# EAGLE design CajitaAbierta_v06_robotique (EAGLE 9.6.2)
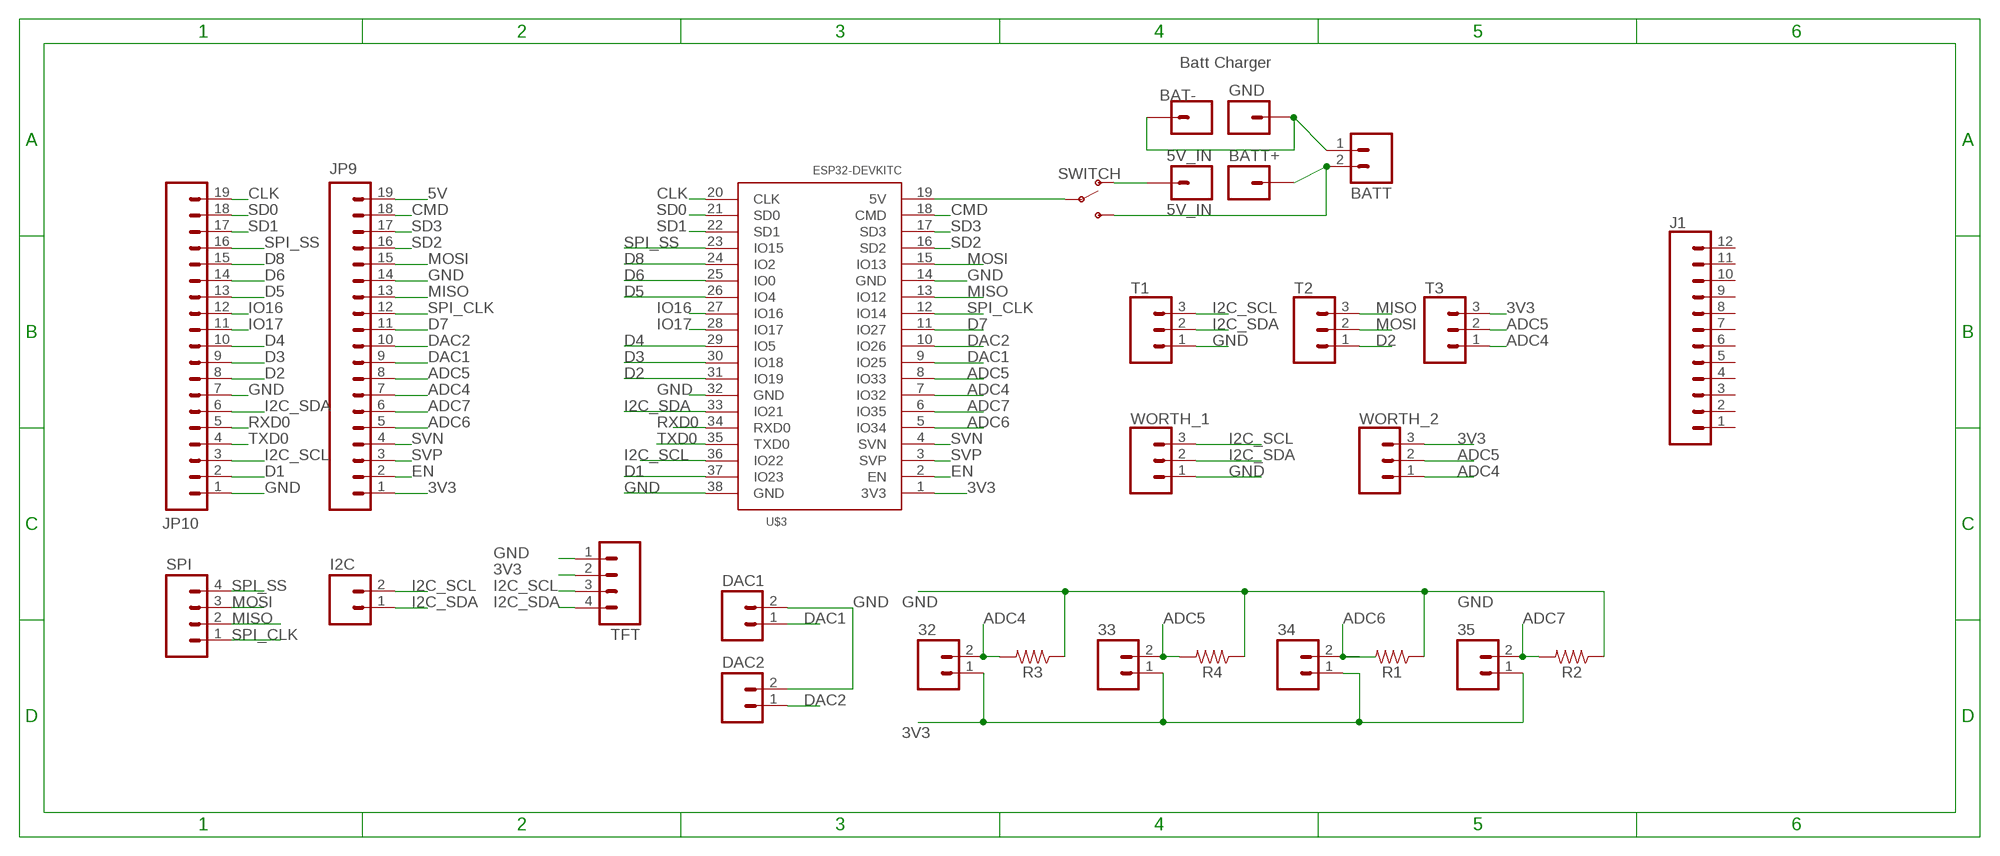
[diagram p0: schematic, sheet 1]

## Parts
5V_IN  5V_IN  M01PTH  [1X01]
32  M02PTH  [1X02]
33  M02PTH  [1X02]
34  M02PTH  [1X02]
35  M02PTH  [1X02]
BAT-  M01PTH  [1X01]
BATT  M02LOCK_LONGPADS  [1X02_LOCK_LONGPADS]
BATT+  M01PTH  [1X01]
DAC1  M02PTH  [1X02]
DAC2  M02PTH  [1X02]
GND  Batt Charger  M01PTH  [1X01]
I2C  M02PTH  [1X02]
J1  CONN_12NO_SILK  [1X12_NO_SILK]
JP9  M191X19  [1X19]
JP10  M191X19  [1X19]
R1  RESISTOR1206  [1206]
R2  RESISTOR1206  [1206]
R3  RESISTOR1206  [1206]
R4  RESISTOR1206  [1206]
SPI  M04PTH  [1X04]
SWITCH  SWITCH-SPDT-SMD-RIGHT-ANGLE  [SWITCH_SPST_SMD_A]
T1  CONN_03SCREW-NS  [SCREWTERMINAL-3.5MM-3-NS]
T2  CONN_03SCREW-NS  [SCREWTERMINAL-3.5MM-3-NS]
T3  CONN_03SCREW-NS  [SCREWTERMINAL-3.5MM-3-NS]
TFT  M04PTH  [1X04]
U$3  ESP32DEVKITC  [ESP32-DEVKITC]
WORTH_1  CONN_03-SCREW-5MM  [SCREWTERMINAL-5MM-3]
WORTH_2  CONN_03-SCREW-5MM  [SCREWTERMINAL-5MM-3]

## Nets
3V3: 32.1 33.1 34.1 35.1 JP9.1 T3.3 TFT.2 U$3.1(3V3) WORTH_2.3
5V: JP9.19 SWITCH.2(P) U$3.19(5V)
5V_IN: 5V_IN.1 SWITCH.1(O)
ADC4: 32.2 JP9.7 R3.2 T3.1 U$3.7(IO32) WORTH_2.1
ADC5: 33.2 JP9.8 R4.2 T3.2 U$3.8(IO33) WORTH_2.2
ADC6: 34.2 JP9.5 R1.2 U$3.5(IO34)
ADC7: 35.2 JP9.6 R2.2 U$3.6(IO35)
BATT+: BATT+.1 BATT.2 SWITCH.3(S)
CLK: JP10.19 U$3.20(CLK)
CMD: JP9.18 U$3.18(CMD)
D1: JP10.2 U$3.37(IO23)
D2: JP10.8 T2.1 U$3.31(IO19)
D3: JP10.9 U$3.30(IO18)
D4: JP10.10 U$3.29(IO5)
D5: JP10.13 U$3.26(IO4)
D6: JP10.14 U$3.25(IO0)
D7: JP9.11 U$3.11(IO27)
D8: JP10.15 U$3.24(IO2)
DAC1: DAC1.1 JP9.9 U$3.9(IO25)
DAC2: DAC2.1 JP9.10 U$3.10(IO26)
EN: JP9.2 U$3.2(EN)
GND: BAT-.1 BATT.1 DAC1.2 DAC2.2 GND.1 JP9.14 JP10.1 JP10.7 R1.1 R2.1 R3.1 R4.1 T1.1 TFT.1 U$3.14(GND) U$3.32(GND) U$3.38(GND) WORTH_1.1
I2C_SCL: I2C.2 JP10.3 T1.3 TFT.3 U$3.36(IO22) WORTH_1.3
I2C_SDA: I2C.1 JP10.6 T1.2 TFT.4 U$3.33(IO21) WORTH_1.2
IO16: JP10.12 U$3.27(IO16)
IO17: JP10.11 U$3.28(IO17)
MISO: JP9.13 SPI.2 T2.3 U$3.13(IO12)
MOSI: JP9.15 SPI.3 T2.2 U$3.15(IO13)
RXD0: JP10.5 U$3.34(RXD0)
SD0: JP10.18 U$3.21(SD0)
SD1: JP10.17 U$3.22(SD1)
SD2: JP9.16 U$3.16(SD2)
SD3: JP9.17 U$3.17(SD3)
SPI_CLK: JP9.12 SPI.1 U$3.12(IO14)
SPI_SS: JP10.16 SPI.4 U$3.23(IO15)
SVN: JP9.4 U$3.4(SVN)
SVP: JP9.3 U$3.3(SVP)
TXD0: JP10.4 U$3.35(TXD0)
Unconnected: J1.1 J1.2 J1.3 J1.4 J1.5 J1.6 J1.7 J1.8 J1.9 J1.10 J1.11 J1.12

## Library data of the parts
5V_IN BAT- BATT+ GND = SparkFun-Connectors:M01: Header 1 Standard 1-pin 0.1" header. Use with straight break away headers (SKU : PRT-00116), right angle break away headers (PRT-00553), swiss pins (PRT-00743), machine pins (PRT-00117), and female headers (PRT-00115).
32-35 BATT DAC1 DAC2 I2C = SparkFun-Connectors:M02: Standard 2-pin 0.1" header. Use with - straight break away headers ( PRT-00116) - right angle break away headers (PRT-00553) - swiss pins (PRT-00743) - machine pins (PRT-00117) - female headers (PRT-00115) Molex polarized connector foot print use with: PRT-08233 with associated crimp pins and housings. 2.54_SCREWTERM for use with PRT-10571. 3.5mm Screw Terminal footprints for PRT-08084 5mm Screw Terminal footprints for use with PRT-08432
J1 = SparkFun-Connectors:CONN_12: Multi connection point. Often used as Generic Header-pin footprint for 0.1 inch spaced/style header connections On any of the 0.1 inch spaced packages, you can populate with these: Break Away Headers - Straight <https://www.sparkfun.com/products/116> (PRT-00116) Break Away Male Headers - Right Angle <https://www.sparkfun.com/products/553> (PRT-00553) Female Headers <https://www.sparkfun.com/products/115> (PRT-00115) Break Away Headers - Machine Pin <https://www.sparkfun.com/products/117> (PRT-00117) Break Away Female Headers - Swiss Machine Pin <https://www.sparkfun.com/products/743> (PRT-00743) For SCREWTERMINALS and SPRING TERMINALS visit here: Screw Terimnals on SparkFun.com <https://www.sparkfun.com/search/results?term=Screw+Terminals> (5mm/3.5mm/2.54mm spacing) This device is also useful as a general connection point to wire up your design to another part of your project. Our various solder wires solder well into these plated through hole pads. Hook-Up Wire - Assortment (Stranded, 22 AWG) <https://www.sparkfun.com/products/11375> (PRT-11375) Hook-Up Wire - Assortment (Solid Core, 22 AWG) <https://www.sparkfun.com/products/11367> (PRT-11367) View the entire wire category on our website here <https://www.sparkfun.com/categories/141> Special notes: Molex polarized connector foot print use with SKU : PRT-08231 with associated crimp pins and housings. 1MM SMD Version SKU: PRT-10208 NOTES ON THE VARIANTS LOCK and LOCK_LONGPADS... This footprint was designed to help hold the alignment of a through-hole component (i.e. 6-pin header) while soldering it into place. You may notice that each hole has been shifted either up or down by 0.005 of an inch from it's more standard position (which is a perfectly straight line). This slight alteration caused the pins (the squares in the middle) to touch the edges of the holes. Because they are alternating, it causes a "brace" to hold the component in place. 0.005 has proven to be the perfect amount of "off-center" position when using our standard breakaway headers. Although looks a little odd when you look at the bare footprint, once you have a header in there, the alteration is very hard to notice. Also,if you push a header all the way into place, it is covered up entirely on the bottom side.
JP9 JP10 = SparkFun-Connectors:M19: 1x19 .1" header
R1-R4 = SparkFun-Resistors:RESISTOR: Generic Resistor Package
SPI TFT = SparkFun-Connectors:M04: Header 4 Standard 4-pin 0.1" header. Use with straight break away headers (SKU : PRT-00116), right angle break away headers (PRT-00553), swiss pins (PRT-00743), machine pins (PRT-00117), and female headers (PRT-00115). Molex polarized connector foot print use with SKU : PRT-08231 with associated crimp pins and housings. 1MM SMD Version SKU: PRT-10208
SWITCH = SparkFun-Switches:SWITCH-SPDT: Single Pole, Double Throw (SPDT) Switch Single-pole, double-throw (SPDT) switch. Variant Overview SMD-AYZ0202 Surface Mount DPDT Switch <https://www.sparkfun.com/products/597> (COM-00597) Used on e.g. LilyPad Arduino USB - ATmega32U4 Board <https://www.sparkfun.com/products/12049> PTH-11.6X4.0MM SPDT Mini Power Switch <https://www.sparkfun.com/products/102> (COM-00102) Used on e.g. SparkFun Simon Says - Through-Hole Soldering Kit <https://www.sparkfun.com/products/10547> (KIT-10547) PTH-11.6X4.0MM-KIT KIT version of SPDT Mini Power Switch - Simplifies soldering by removing tStop of switch pins - only one side can be soldered. PTH-11.6X4.0MM-LOCK LOCK version of SPDT Mini Power Switch - Offset pins hold switch in place for easier soldering. SMD-RIGHT-ANGLE Surface Mount Right Angle Switch <https://www.sparkfun.com/products/10860> (COM-10860) Used on e.g. SparkFun ESP8266 Thing <https://www.sparkfun.com/products/13231>; PROD_ID: SWCH-10651; SF_SKU: COM-10860
T1-T3 = SparkFun-Connectors:CONN_03: Multi connection point. Often used as Generic Header-pin footprint for 0.1 inch spaced/style header connections On any of the 0.1 inch spaced packages, you can populate with these: Break Away Headers - Straight <https://www.sparkfun.com/products/116> (PRT-00116) Break Away Male Headers - Right Angle <https://www.sparkfun.com/products/553> (PRT-00553) Female Headers <https://www.sparkfun.com/products/115> (PRT-00115) Break Away Headers - Machine Pin <https://www.sparkfun.com/products/117> (PRT-00117) Break Away Female Headers - Swiss Machine Pin <https://www.sparkfun.com/products/743> (PRT-00743) Stackable Header - 3 Pin (Female, 0.1") <https://www.sparkfun.com/products/13875> (PRT-13875) For SCREWTERMINALS and SPRING TERMINALS visit here: Screw Terimnals on SparkFun.com <https://www.sparkfun.com/search/results?term=Screw+Terminals> (5mm/3.5mm/2.54mm spacing) This device is also useful as a general connection point to wire up your design to another part of your project. Our various solder wires solder well into these plated through hole pads. Hook-Up Wire - Assortment (Stranded, 22 AWG) <https://www.sparkfun.com/products/11375> (PRT-11375) Hook-Up Wire - Assortment (Solid Core, 22 AWG) <https://www.sparkfun.com/products/11367> (PRT-11367) View the entire wire category on our website here <https://www.sparkfun.com/categories/141> Special notes: Molex polarized connector foot print use with SKU : PRT-08232 with associated crimp pins and housings.
U$3 = ESP32-DEVKITC:ESP32DEVKITC
WORTH_1 WORTH_2 = SparkFun-Connectors:CONN_03: Multi connection point. Often used as Generic Header-pin footprint for 0.1 inch spaced/style header connections On any of the 0.1 inch spaced packages, you can populate with these: Break Away Headers - Straight <https://www.sparkfun.com/products/116> (PRT-00116) Break Away Male Headers - Right Angle <https://www.sparkfun.com/products/553> (PRT-00553) Female Headers <https://www.sparkfun.com/products/115> (PRT-00115) Break Away Headers - Machine Pin <https://www.sparkfun.com/products/117> (PRT-00117) Break Away Female Headers - Swiss Machine Pin <https://www.sparkfun.com/products/743> (PRT-00743) Stackable Header - 3 Pin (Female, 0.1") <https://www.sparkfun.com/products/13875> (PRT-13875) For SCREWTERMINALS and SPRING TERMINALS visit here: Screw Terimnals on SparkFun.com <https://www.sparkfun.com/search/results?term=Screw+Terminals> (5mm/3.5mm/2.54mm spacing) This device is also useful as a general connection point to wire up your design to another part of your project. Our various solder wires solder well into these plated through hole pads. Hook-Up Wire - Assortment (Stranded, 22 AWG) <https://www.sparkfun.com/products/11375> (PRT-11375) Hook-Up Wire - Assortment (Solid Core, 22 AWG) <https://www.sparkfun.com/products/11367> (PRT-11367) View the entire wire category on our website here <https://www.sparkfun.com/categories/141> Special notes: Molex polarized connector foot print use with SKU : PRT-08232 with associated crimp pins and housings.; PROD_ID: CONN-10134; SF_SKU: PRT-08433

## Board
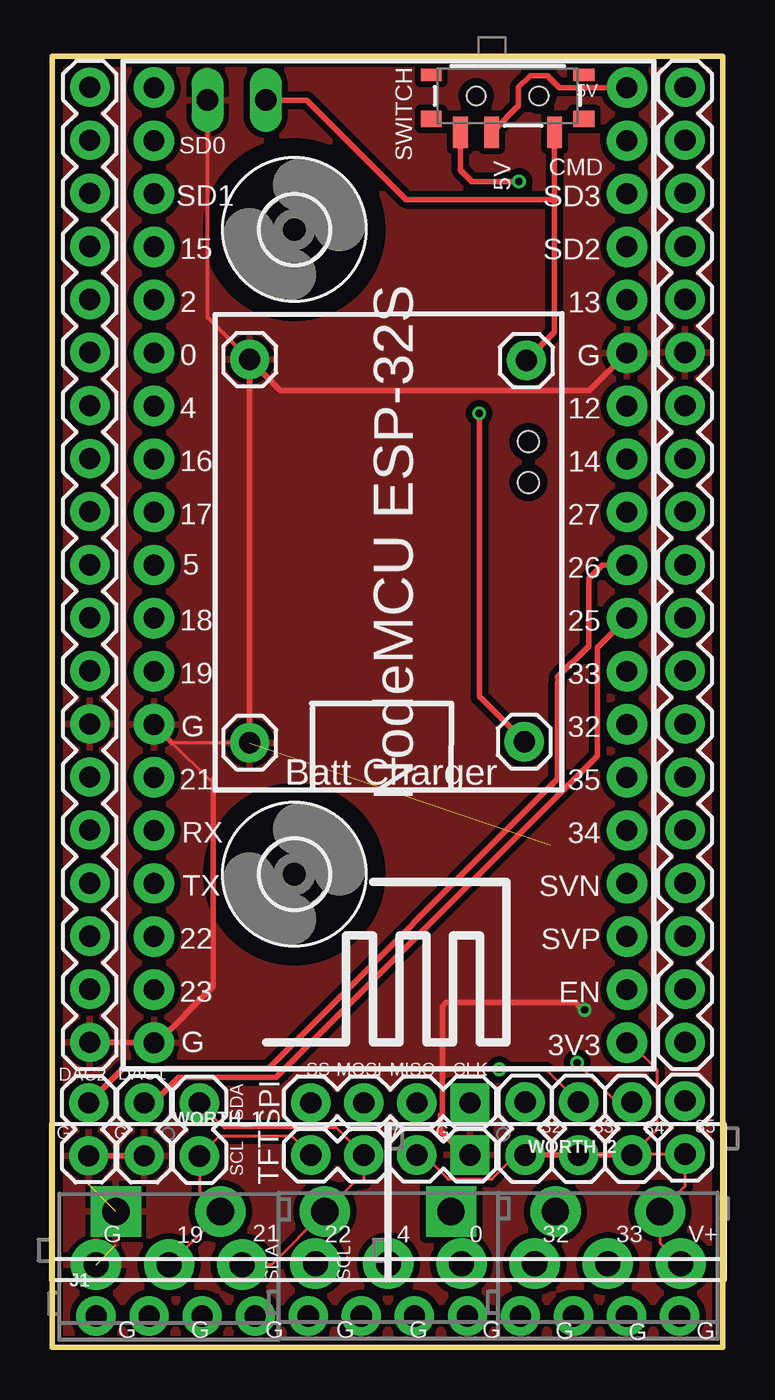
[diagram p1: board, top side]
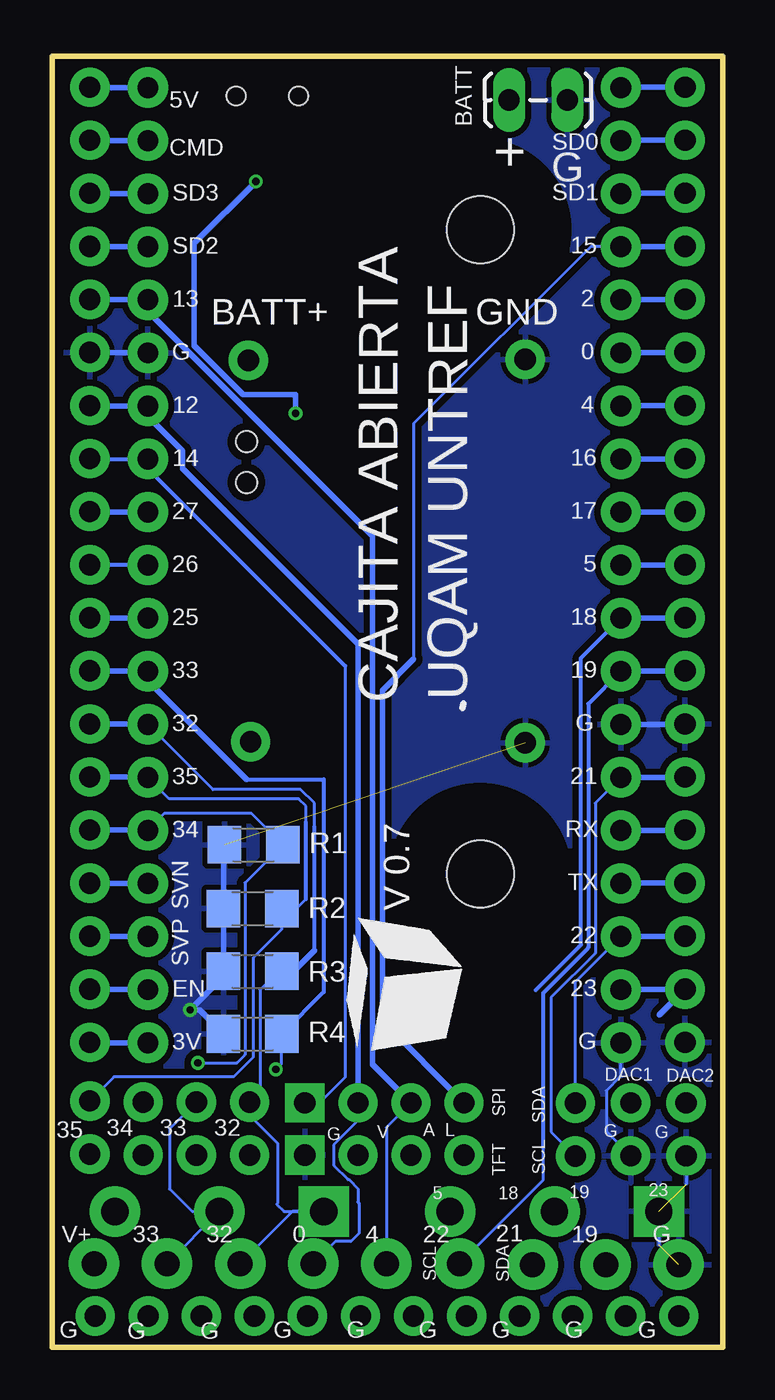
[diagram p2: board, bottom side, seen from below]

Size 32.1 x 61.8 mm. Coordinates in mm from the lower left corner, seen from the top.
Outline: 32.1,61.8 32.1,0 0,0 0,61.8 32.1,61.8
Copper layers (1*16): Top 0.035mm / dielectric 1.5mm / Bottom 0.035mm
Design rules "NOA Eagle Rule 2016-06-12": minimum track width 6mil, minimum drill 0.3mm, track to track 6mil, track to pad 6mil, pad to pad 6mil, via to via 6mil, smd to smd 0mil, copper to edge 0.4mm, drill to drill 10mil, minimum pad ring 10mil, minimum via ring 6mil, stop-mask expansion 2mil, vias tented up to drill 25mil, thermal gap 10mil
Holes 1 mm at 22.8,43.35 22.8,41.4

### Footprints (pad centres in the part's own frame; a part is rotated, then mirrored left to right if it is on the bottom)
1X01 = drill 1.016 pad 1.88: 1 0,0
1X02 = drill 1.016 pad 1.88: 1 0,0; 2 2.54,0
1X02_LOCK_LONGPADS = drill 1.016 long: 1 -0.127,0; 2 2.667,0
1X12_NO_SILK = drill 1.016 pad 1.88: 1 0,0; 2 2.54,0; 3 5.08,0; 4 7.62,0; 5 10.16,0; 6 12.7,0; 7 15.24,0; 8 17.78,0; 9 20.32,0; 10 22.86,0; 11 25.4,0; 12 27.94,0
1X19 = drill 1.016 pad 1.88: 1 0,0; 2 2.54,0; 3 5.08,0; 4 7.62,0; 5 10.16,0; 6 12.7,0; 7 15.24,0; 8 17.78,0; 9 20.32,0; 10 22.86,0; 11 25.4,0; 12 27.94,0; 13 30.48,0; 14 33.02,0; 15 35.56,0; 16 38.1,0; 17 40.64,0; 18 43.18,0; 19 45.72,0
1206 = smd 1.6 x 1.8: 1 -1.4,0; 2 1.4,0
1X04 = drill 1.016 pad 1.88 square: 1 0,0 | drill 1.016 pad 1.88: 2 2.54,0; 3 5.08,0; 4 7.62,0
SWITCH_SPST_SMD_A = smd 0.7 x 1.5: 1 -2.25,-1.75; 2 -0.75,-1.75; 3 2.25,-1.75 | smd 1 x 0.6: GND1 -3.65,1; GND3 3.65,1 | smd 1 x 0.8: GND2 -3.65,-1.1; GND4 3.65,-1.1 | hole 0.9: -1.5,0; 1.5,0
SCREWTERMINAL-3.5MM-3-NS = drill 1.2 pad 2.413: 1 0,0; 2 3.5,0; 3 7,0
3,2 = hole 3.2: 0,0
ESP32-DEVKITC = drill 1 pad 1.93: 1 -22.87,-11.42; 2 -20.33,-11.42; 3 -17.79,-11.42; 4 -15.25,-11.42; 5 -12.71,-11.42; 6 -10.17,-11.42; 7 -7.63,-11.42; 8 -5.09,-11.42; 9 -2.55,-11.42; 10 -0.01,-11.42; 11 2.53,-11.42; 12 5.07,-11.42; 13 7.61,-11.42; 14 10.15,-11.42; 15 12.69,-11.42; 16 15.23,-11.42; 17 17.77,-11.42; 18 20.31,-11.42; 19 22.85,-11.42; 20 22.85,11.23; 21 20.31,11.23; 22 17.77,11.23; 23 15.23,11.23; 24 12.69,11.23; 25 10.15,11.23; 26 7.61,11.23; 27 5.07,11.23; 28 2.53,11.23; 29 -0.01,11.23; 30 -2.55,11.23; 31 -5.09,11.23; 32 -7.63,11.23; 33 -10.17,11.23; 34 -12.71,11.23; 35 -15.25,11.23; 36 -17.79,11.23; 37 -20.33,11.23; 38 -22.87,11.23
SCREWTERMINAL-5MM-3 = drill 1.3 pad 2.413 square: 1 0,0 | drill 1.3 pad 2.413: 2 5,0; 3 10,0

### Placement (x,y rotation side)
5V_IN  22.6,28.99 0 top
32  22.65,9.2 90 top
33  25.2,9.2 90 top
34  27.75,9.2 90 top
35  30.3,9.25 90 top
BAT-  9.45,28.94 0 top
BATT  7.56,59.71 180 bottom
BATT+  22.7,47.24 0 top
DAC1  4.4,11.7 270 top
DAC2  1.75,11.7 270 top
GND  9.45,47.29 0 top
I2C  7.05,9.15 90 top
J1  2.1,1.5 0 top
JP9  30.3,14.6 90 top
JP10  1.8,14.6 90 top
R1  22.45,24.05 0 bottom
R2  22.5,21 0 bottom
R3  22.5,18 0 bottom
R4  22.5,15 0 bottom
SPI  20,11.7 180 top
SWITCH  21.8,59.9 0 top
T1  2.1,3.95 0 top
T2  12.6,4 0 top
T3  23.1,4 0 top
TFT  20,9.2 180 top
U$1  [3,2]  11.6,53.5 0 top
U$2  [3,2]  11.6,22.65 0 top
U$3  16.1,37.45 90 top
WORTH_1  3.05,6.5 0 top
WORTH_2  19.1,6.5 0 top

### Tracks (layer width: path | path; a pad name or v marks a point on that pad's centre or on a via)
3V3
  Top 0.152: U$3.1 27.67,14.58 28.95,13.3 28.95,10.4 34.1 27.8,9.25 35.1 30.3,7.7 WORTH_2.3 29.1,5 T3.3 | 32.1 22.2,9.2 21.03,8.03 18.97,8.03 17.8,9.2 TFT.2
  Top 0.254: 34.1 33.1 32.1
  Bottom 0.254: JP9.1 30.28,14.58 U$3.1
5V
  Top 0.254: U$3.19 24.28,60.3 23.7,60.88 22.89,60.88 22.32,60.3 22.32,59.42 SWITCH.2
  Bottom 0.254: U$3.19 30.28,60.3 JP9.19
5V_IN  (via drill 0.35)
  Top 0.254: v20.45,44.7 20.45,31.14 5V_IN.1 | v22.35,55.8 20.1,55.8 19.55,56.35 SWITCH.1
  Bottom 0.254: v22.35,55.8 25.3,52.85 25.3,47.95 22.95,45.6 20.45,45.6 v20.45,44.7
ADC4
  Bottom 0.152: 21.2,17.9 R3.2 21.26,18 22.15,17.11 22.15,12.24 32.2 22.65,11.1 21.3,9.75 21.3,6.9 21.35,6.85 21,6.5 WORTH_2.1 20.6,6.5 T3.1 | 19.55,24.93 19.55,26.05 20.2,26.7 24.4,26.7 27.54,29.84
  Bottom 0.2: 19.55,19 19.55,24.93
  Bottom 0.254: U$3.7 27.54,29.84 JP9.7 | 19.55,19 20.65,17.9 21.2,17.9
ADC5  (via drill 0.35)
  Top 0.152: v21.4,13.3 23.64,13.3 33.2
  Bottom 0.152: R4.2 21.15,14.95 21.15,13.55 v21.4,13.3 | 33.2 26.48,10.46 26.48,7.58 25.4,6.5 WORTH_2.2 T3.2
  Bottom 0.2: 22.8,27.19 19.1,27.19 19.1,17 R4.2
  Bottom 0.254: 22.8,27.19 27.52,31.91 U$3.8 27.54,32.38 JP9.8
ADC6  (via drill 0.35)
  Top 0.152: 34.2 27.01,11.74 v25.13,13.62
  Bottom 0.152: v25.13,13.62 23.26,13.62 22.87,14.01 22.87,22.23 R1.2 22.55,25.55 26.75,25.55 27.54,24.76
  Bottom 0.254: U$3.5 27.54,24.76 JP9.5
ADC7
  Bottom 0.152: 19.95,21.45 20.4,21 R2.2 21.1,20.02 22.48,18.64 22.48,13.88 23.41,12.95 29.14,12.95 35.2 | 19.95,25.14 19.95,25.9 20.3,26.25 26.49,26.25 U$3.6
  Bottom 0.2: 19.95,21.45 19.95,25.14
  Bottom 0.254: U$3.6 27.54,27.3 JP9.6
BATT+
  Top 0.254: 24.05,55 24.11,54.94 16.94,54.94 12.18,59.71 BATT.2 | SWITCH.3 24.05,55 | BATT+.1 24.05,48.58 24.05,55
CLK
  Bottom 0.254: JP10.19 4.85,60.32 U$3.20
CMD
  Bottom 0.254: U$3.18 30.28,57.76 JP9.18
D1
  Bottom 0.254: 3.02,15.92 JP10.2 1.82,17.12 U$3.37
D2
  Bottom 0.152: T2.1 8.59,8.01 8.59,9.56
  Bottom 0.2: U$3.31 6.43,30.8 6.43,19.12 8.59,16.96 8.59,9.56
  Bottom 0.254: U$3.31 1.82,32.36 JP10.8
D3
  Bottom 0.2: U$3.30 6.78,32.99 6.78,19.27 8.95,17.1
  Bottom 0.254: JP10.9 1.82,34.9 U$3.30
D4
  Bottom 0.254: U$3.29 1.82,37.44 JP10.10
D5
  Bottom 0.254: JP10.13 4.85,45.08 U$3.26
D6
  Bottom 0.254: JP10.14 4.85,47.62 U$3.25
D7
  Bottom 0.254: JP9.11 30.28,39.98 U$3.11
D8
  Bottom 0.254: U$3.24 1.82,50.14 JP10.15
DAC1
  Top 0.254: U$3.9 26.11,33.49 26.11,28.31 10.71,12.91 6.04,12.91 4.84,11.7 DAC1.1
  Bottom 0.254: U$3.9 30.28,34.9 JP9.9
DAC2
  Top 0.2: 24.2,31.82 24.2,32.08
  Top 0.254: 24.2,32.08 25.7,33.58 25.7,36.8 26.34,37.44 U$3.10 | DAC2.1 3.38,13.34 5.39,13.34 5.4,13.35 10.35,13.35 24.2,27.2 24.2,31.82
  Bottom 0.2: U$3.10 30.28,37.44 JP9.10
EN
  Bottom 0.254: U$3.2 30.28,17.12 JP9.2
GND  (via drill 0.35)  (3 unrouted)
  Top 0.152: 7.7,27.19 7.5,27.19 5.75,28.94 BAT-.1
  Top 0.2: GND.1 7.43,49.31 BATT.1
  Top 0.254: DAC1.2 DAC2.2 | U$3.14 25.72,45.8 10.94,45.8 GND.1 BAT-.1 | U$3.32 5.75,28.94 | JP10.1 4.85,14.6 U$3.38 5.02,14.58 7.7,17.26 7.7,27.19 | TFT.1 19.75,9.2 18.6,10.35 18.6,11.12 18.68,11.2 18.68,16.33 18.85,16.5 25.05,16.5 25.3,16.25 25.3,16.15 v25.5,16.15
  Bottom 0.152: U$3.38 4.87,12.98 5.57,12.28 5.57,10.33 DAC1.2 | DAC2.2 1.75,7.8 | WORTH_1.1 3.05,4.9
  Bottom 0.254: U$3.32 1.82,29.82 JP10.7 | JP9.14 27.54,47.62 U$3.14 | R4.1 25.05,16.15 v25.5,16.15 23.9,17.75 R3.1 R2.1 23.9,24 R1.1
  pour Top (isolate 0.305): 32.1,0 0,0 0,61.8 32.1,61.8
  pour Bottom (isolate 0.305): 32.1,0 0,0 0,61.8 32.1,61.8
I2C_SCL
  Top 0.152: I2C.2 8.24,10.5 13.62,10.5 TFT.3 14.92,7.92 14.47,7.92 WORTH_1.3 10.5,3.95 T1.3
  Bottom 0.152: I2C.2 7.05,17.48 U$3.36
  Bottom 0.254: JP10.3 1.82,19.66 U$3.36
I2C_SDA
  Top 0.152: TFT.4 11.48,10.1 8,10.1 I2C.1 7.05,7.5 WORTH_1.2 8.05,6.4 T1.2
  Bottom 0.152: U$3.33 6.1,26.05 6.1,18.86 8.22,16.74 8.22,10.32 I2C.1
  Bottom 0.254: U$3.33 1.82,27.28 JP10.6
IO16
  Bottom 0.254: U$3.27 1.82,42.52 JP10.12
IO17
  Bottom 0.254: U$3.28 1.82,39.98 JP10.11
MISO
  Bottom 0.152: SPI.2 17.46,10.85 18.63,9.68 18.63,8.72 17.94,8.03 17.89,8.03 17.46,7.6 17.46,6.96 17.4,6.9 17.4,5.46 17.8,5.07 18.54,5.07 T2.3
  Bottom 0.254: JP9.13 30.28,45.06 U$3.13 27.52,44.57 25.85,42.9 25.85,42.05 17.46,33.66 SPI.2
MOSI
  Bottom 0.152: SPI.3 16.1,10.52 T2.2
  Bottom 0.254: JP9.15 30.28,50.14 U$3.15 27.52,49.59 16.77,38.84 16.77,13.55 SPI.3
RXD0
  Bottom 0.254: U$3.34 1.82,24.74 JP10.5
SD0
  Bottom 0.254: JP10.18 4.85,57.78 U$3.21
SD1
  Bottom 0.254: JP10.17 4.85,55.24 U$3.22
SD2
  Bottom 0.254: U$3.16 30.28,52.68 JP9.16
SD3
  Bottom 0.254: U$3.17 30.28,55.22 JP9.17
SPI_CLK
  Bottom 0.152: SPI.1 19.3,11.7 18.07,12.93 18.07,32.62
  Bottom 0.2: JP9.12 30.28,42.52 U$3.12 27.52,42.07 18.07,32.62
SPI_SS
  Bottom 0.152: U$3.23 6.32,52.68 14.8,44.2 14.8,32.93
  Bottom 0.254: SPI.4 16.3,15.62 16.3,31.43 14.8,32.93 | U$3.23 1.82,52.68 JP10.16
SVN
  Bottom 0.254: U$3.4 30.28,22.2 JP9.4
SVP
  Bottom 0.254: U$3.3 30.28,19.66 JP9.3
TXD0
  Bottom 0.254: JP10.4 4.85,22.22 U$3.35

### Text on the board
tNames: 5V | SS | MOSI | MISO | CLK | DAC2 | DAC1 | SDA | G | G | V | G | 34 | SCL | G | 19 | 21 | 22 | 4 | 0 | 32 | 33 | V+ | SDA | SCL | G | G | G | G | G | G | G | G | G
bNames: G | + | UQAM UNTREF | GND | BATT+ | CAJITA ABIERTA | V 0.7 | DAC2 | DAC1 | SDA | SPI | G | G | SCL | A L | V | G | 32 | 33 | 34 | 35 | TFT | 23 | 19 | 18 | 5 | G | 19 | SDA | 21 | SCL | 22 | 4 | 0 | 32 | 33 | V+ | G | G | G | G | G | G | G | G | G
uqam: v0.2
noms_b: V+ | 3V3 | G | D4 | D7 | D2 | A0
192bmp: /Users/uqam/Desktop/ohanda_logo.bmp
noms_t: G | DHT11 | D7 | SPKR | 3V | A0 | D2 | G | DEL | V+ | D2 | A0 | D4 | D7 | G | G | V+ | 3V3 | V+ | MQ-7 | V+ | PWR | G
225bmp: /Users/uqam/Documents/AgitPOV_WiFi/logo_texte_gagarin.bmp